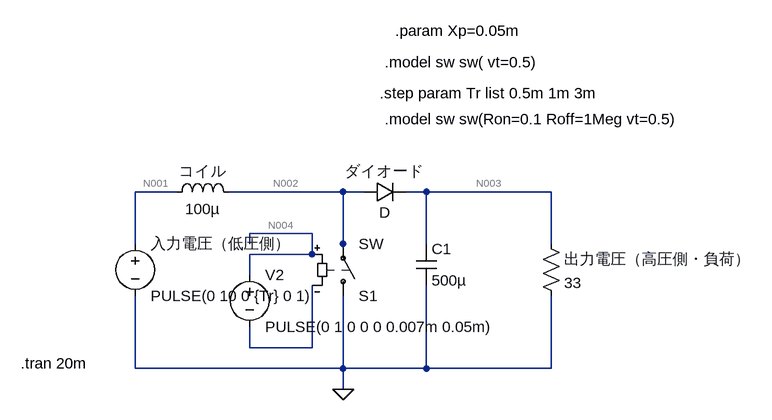
[diagram p0: schematic sample1.asc]
sample1.asc, the LTspice schematic file:
Version 4
SHEET 1 880 680
WIRE -32 32 -96 32
WIRE 224 32 48 32
WIRE 256 32 224 32
WIRE 352 32 320 32
WIRE 544 32 352 32
WIRE 176 96 80 96
WIRE -96 112 -96 32
WIRE 80 112 80 96
WIRE 224 112 224 32
WIRE 352 112 352 32
WIRE 544 112 544 32
WIRE 176 128 176 96
WIRE 176 128 80 128
WIRE 224 128 224 112
WIRE 80 160 80 128
WIRE 80 272 80 240
WIRE 176 272 176 176
WIRE 176 272 80 272
WIRE -96 304 -96 192
WIRE 224 304 224 192
WIRE 224 304 -96 304
WIRE 352 304 352 176
WIRE 352 304 224 304
WIRE 544 304 544 192
WIRE 544 304 352 304
WIRE 224 336 224 304
FLAG 224 336 0
SYMBOL voltage -96 96 R0
WINDOW 123 0 0 Left 0
WINDOW 39 0 0 Left 0
SYMATTR InstName 入力電圧（低圧側）
SYMATTR Value PULSE(0 10 0 {Tr} 0 1)
SYMBOL ind -48 48 R270
WINDOW 3 5 56 VBottom 2
WINDOW 0 32 56 VTop 2
SYMATTR Value 100µ
SYMATTR InstName コイル
SYMBOL voltage 80 144 R0
WINDOW 123 0 0 Left 0
WINDOW 39 0 0 Left 0
SYMATTR InstName V2
SYMATTR Value PULSE(0 1 0 0 0 0.007m 0.05m)
SYMBOL sw 224 208 M180
SYMATTR InstName S1
SYMBOL cap 336 112 R0
SYMATTR InstName C1
SYMATTR Value 500µ
SYMBOL res 528 96 R0
SYMATTR InstName 出力電圧（高圧側・負荷）
SYMATTR Value 33
SYMBOL diode 256 48 R270
WINDOW 0 32 32 VTop 2
WINDOW 3 0 32 VBottom 2
SYMATTR InstName ダイオード
TEXT -272 296 Left 2 !.tran 20m
TEXT 280 -120 Left 2 !.step param Tr list 0.5m 1m 3m
TEXT 288 -168 Left 2 !.model sw sw( vt=0.5)
TEXT 288 -80 Left 2 !.model sw sw(Ron=0.1 Roff=1Meg vt=0.5)
TEXT 304 -216 Left 2 !.param Xp=0.05m

The netlist it stands for:
* sample1.asc
V§入力電圧（低圧側） N001 0 PULSE(0 10 0 {Tr} 0 1)
L§コイル N001 N002 100µ
V2 N004 N005 PULSE(0 1 0 0 0 0.007m 0.05m)
S1 0 N002 N004 N005 SW
C1 N003 0 500µ
R§出力電圧（高圧側・負荷） N003 0 33
D§ダイオード N002 N003 D
.model D D
.lib standard.dio
.tran 20m
.step param Tr list 0.5m 1m 3m
.model sw sw( vt=0.5)
.model sw sw(Ron=0.1 Roff=1Meg vt=0.5)
.param Xp=0.05m
.backanno
.end

* Results of the author's LTspice run, read from the files saved beside the schematic
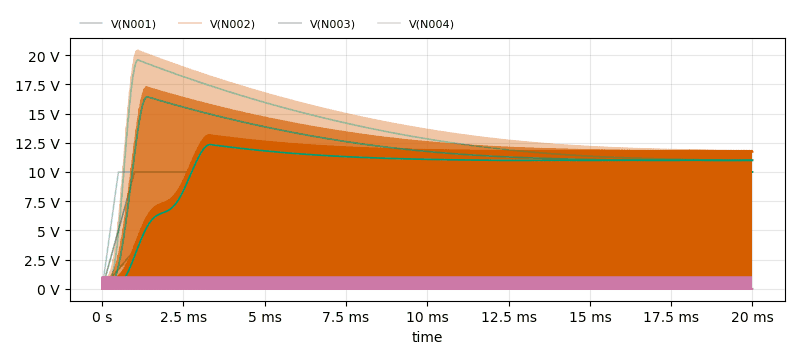
[diagram p1: Transient Analysis of sample1.asc, plotted from the saved traces]
* Transient Analysis, 3 runs:
*   V(N001) [tr=0.0005]: min 0 V, max 10 V, average 9.875 V, rms 9.916 V, last 10 V
*   V(N001) [tr=0.001]: min 0 V, max 10 V, average 9.75 V, rms 9.832 V, last 10 V
*   V(N001) [tr=0.003]: min 0 V, max 10 V, average 9.25 V, rms 9.487 V, last 10 V
*   V(N002) [tr=0.0005]: min 0 V, max 20.41 V, average 9.872 V, rms 11 V, last 11.7 V
*   V(N002) [tr=0.001]: min 0 V, max 17.26 V, average 9.746 V, rms 10.81 V, last 11.74 V
*   V(N002) [tr=0.003]: min 0 V, max 13.17 V, average 9.252 V, rms 10.32 V, last 11.74 V
*   V(N003) [tr=0.0005]: min 0 V, max 19.59 V, average 13.22 V, rms 13.61 V, last 11 V
*   V(N003) [tr=0.001]: min 0 V, max 16.44 V, average 11.93 V, rms 12.22 V, last 11 V
*   V(N003) [tr=0.003]: min 0 V, max 12.35 V, average 10.29 V, rms 10.62 V, last 11 V
*   V(N004) [tr=0.0005]: min 0 V, max 1 V, average 154 mV, rms 387.4 mV, last 0 V
*   V(N004) [tr=0.001]: min 0 V, max 1 V, average 154 mV, rms 387.3 mV, last 0 V
*   V(N004) [tr=0.003]: min 0 V, max 1 V, average 154 mV, rms 387.3 mV, last 0 V